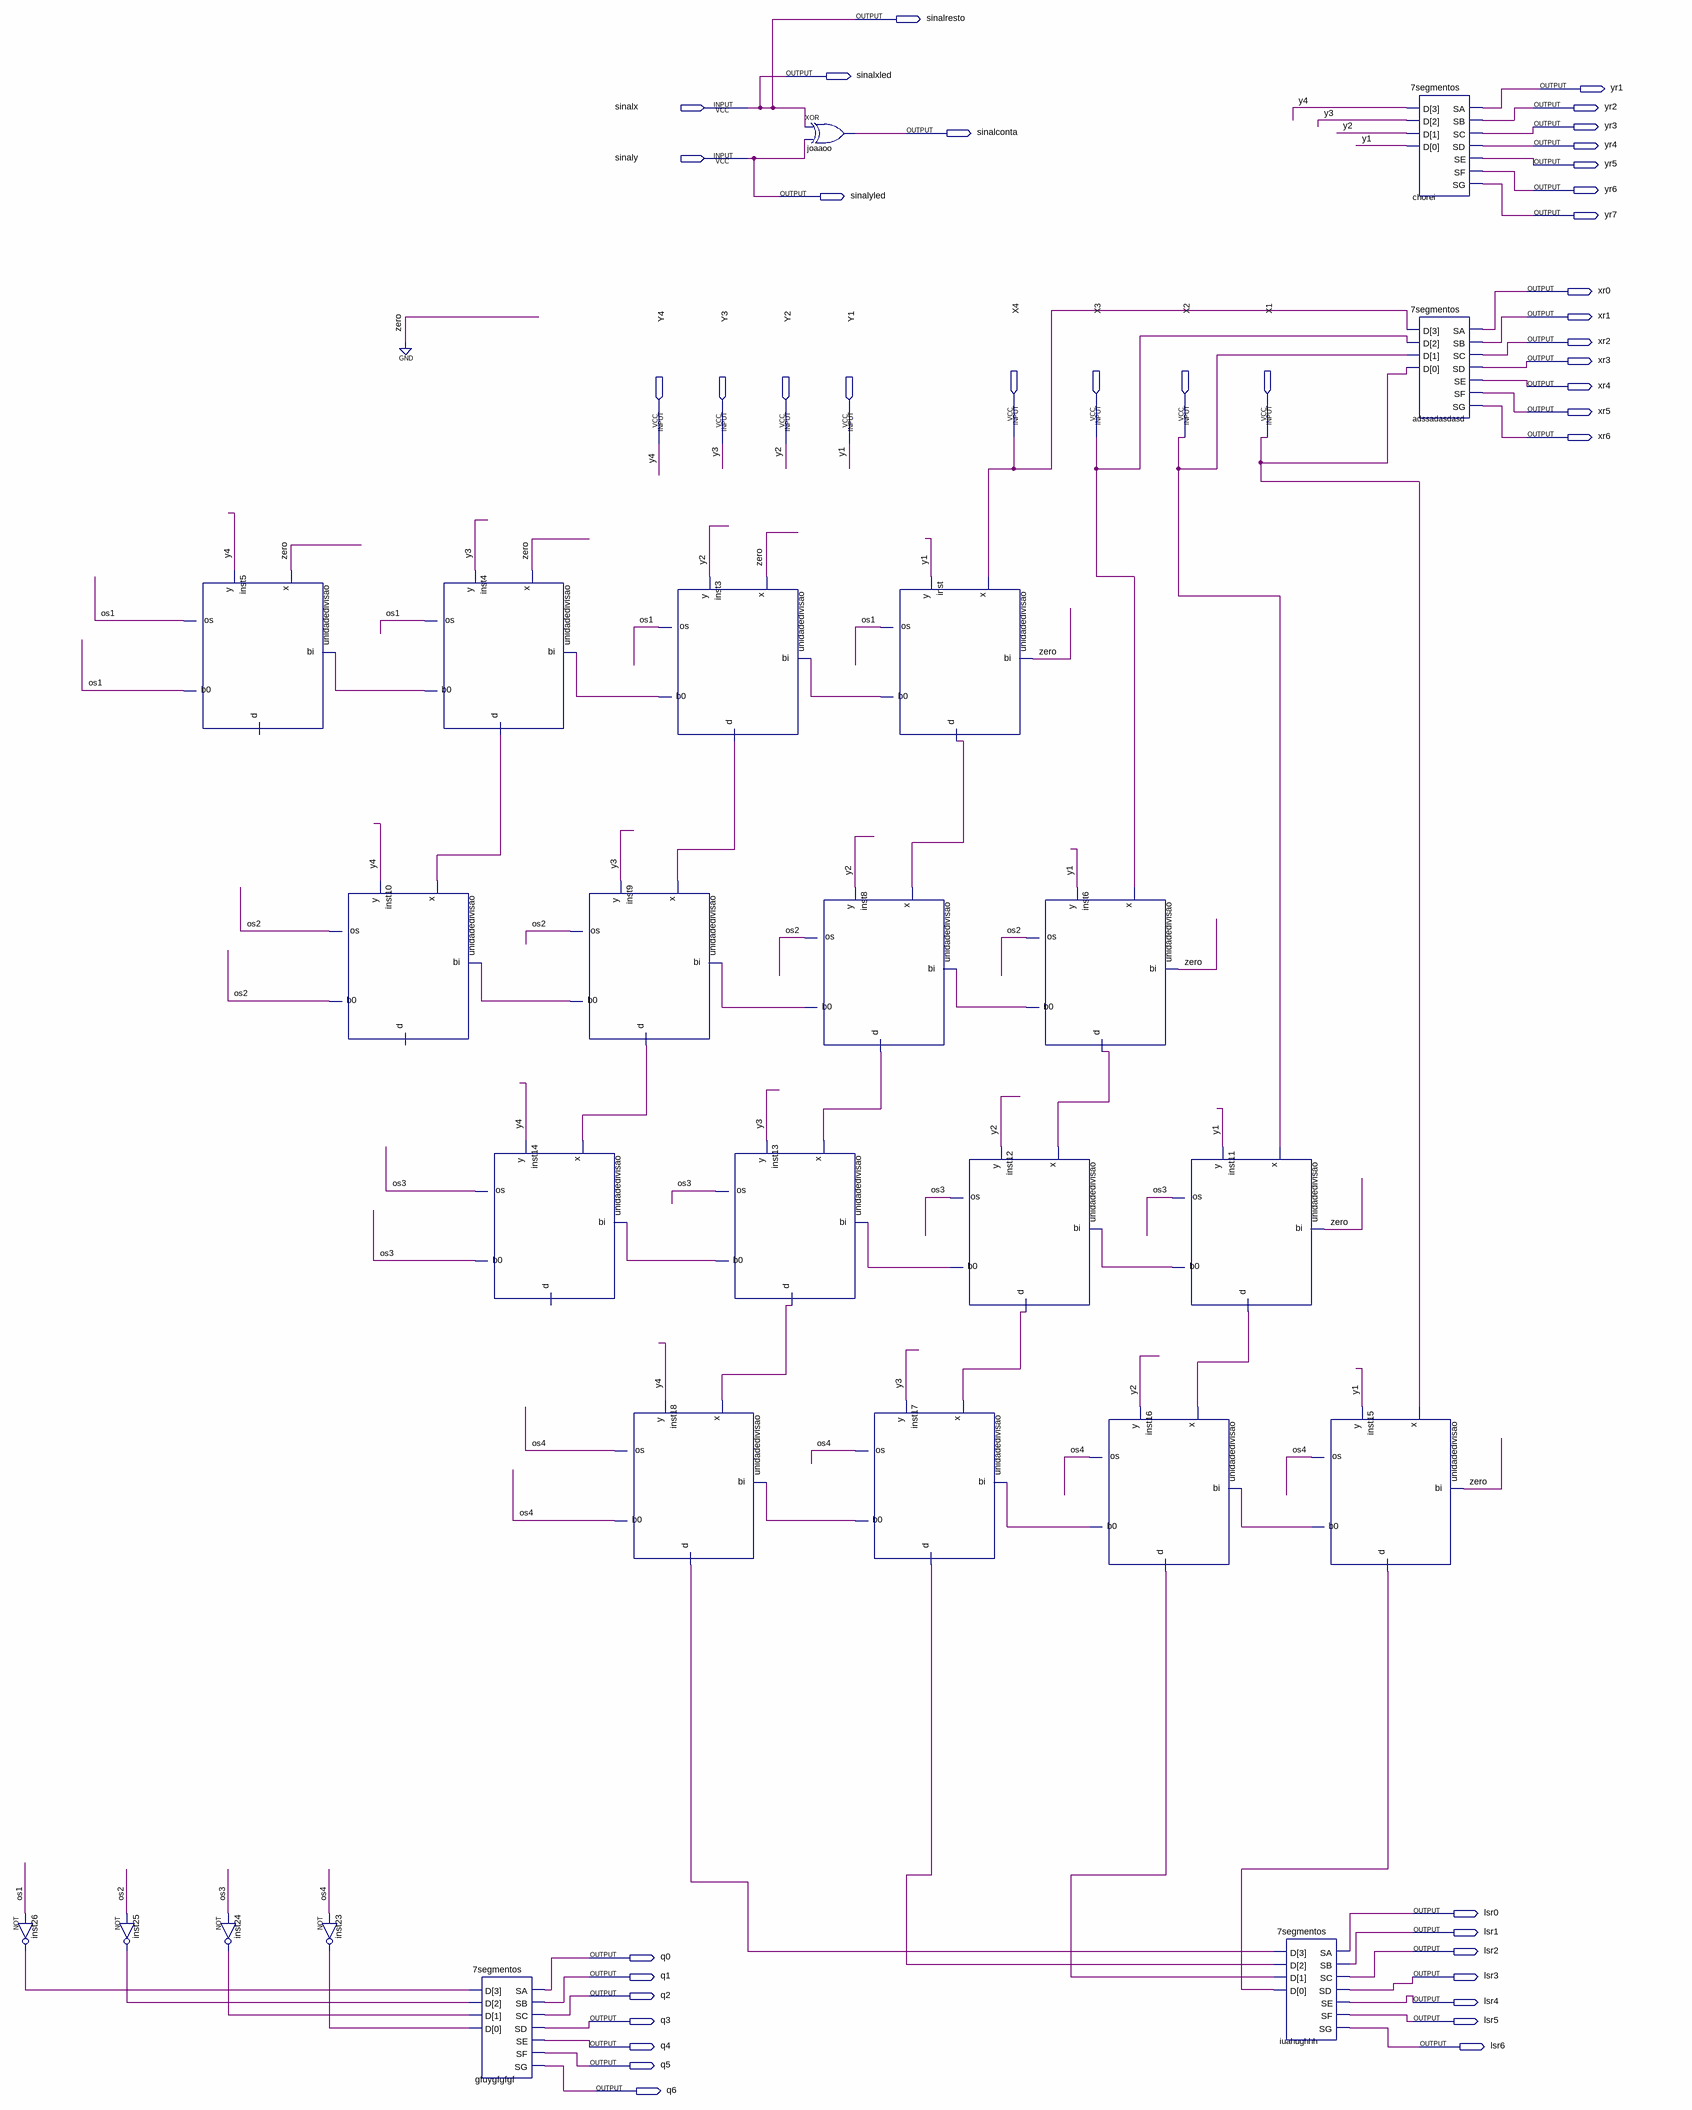
[diagram p0: schematic sheet]
// Quartus schematic divisor.bdf as structural Verilog: 25 symbols, 42 pins
module divisor (
  input  sinalx,
  input  sinaly,
  input  X4,
  input  X3,
  input  X2,
  input  X1,
  input  Y4,
  input  Y3,
  input  Y2,
  input  Y1,
  output sinalresto,
  output sinalxled,
  output yr1,
  output yr2,
  output yr3,
  output sinalconta,
  output yr4,
  output yr5,
  output yr6,
  output sinalyled,
  output yr7,
  output xr0,
  output xr1,
  output xr2,
  output xr3,
  output xr4,
  output xr5,
  output xr6,
  output lsr0,
  output lsr1,
  output lsr2,
  output q0,
  output q1,
  output lsr3,
  output q2,
  output lsr4,
  output q3,
  output lsr5,
  output q4,
  output lsr6,
  output q5,
  output q6
);

  wire inst3_b0, inst3_d, inst4_b0, inst4_d, inst6_b0, inst6_d, inst8_b0, inst8_d, inst9_b0, inst9_d,
       inst11_b0, inst11_d, inst12_b0, inst12_d, inst13_b0, inst13_d, inst15_b0, inst15_d, inst16_b0,
       inst16_d, inst17_b0, inst17_d, inst18_d, inst23_out, inst24_out, inst25_out, inst26_out, inst_b0,
       inst_d, os1, os2, os3, os4;

  not inst26 (inst26_out, os1);
  not inst25 (inst25_out, os2);
  unidadedivisao inst5 (.os(os1), .bi(inst4_b0), .y(Y4), .x(1'b0), .b0(os1));  // open: d
  not inst24 (inst24_out, os3);
  unidadedivisao inst10 (.os(os2), .bi(inst9_b0), .y(Y4), .x(inst4_d), .b0(os2));  // open: d
  not inst23 (inst23_out, os4);
  unidadedivisao inst4 (.os(os1), .bi(inst3_b0), .y(Y3), .x(1'b0), .b0(inst4_b0), .d(inst4_d));
  unidadedivisao inst14 (.os(os3), .bi(inst13_b0), .y(Y4), .x(inst9_d), .b0(os3));  // open: d
  \7segmentos  gfuygfgfgf (
    .D({inst26_out, inst25_out, inst24_out, inst23_out}), .SA(q0), .SB(q1), .SC(q2), .SD(q3), .SE(q4),
    .SF(q5), .SG(q6));
  unidadedivisao inst9 (.os(os2), .bi(inst8_b0), .y(Y3), .x(inst3_d), .b0(inst9_b0), .d(inst9_d));
  unidadedivisao inst18 (.os(os4), .bi(inst17_b0), .y(Y4), .x(inst13_d), .b0(os4), .d(inst18_d));
  unidadedivisao inst3 (.os(os1), .bi(inst_b0), .y(Y2), .x(1'b0), .b0(inst3_b0), .d(inst3_d));
  unidadedivisao inst13 (.os(os3), .bi(inst12_b0), .y(Y3), .x(inst8_d), .b0(inst13_b0), .d(inst13_d));
  xor joaaoo (sinalconta, sinalx, sinaly);
  unidadedivisao inst8 (.os(os2), .bi(inst6_b0), .y(Y2), .x(inst_d), .b0(inst8_b0), .d(inst8_d));
  unidadedivisao inst17 (.os(os4), .bi(inst16_b0), .y(Y3), .x(inst12_d), .b0(inst17_b0), .d(inst17_d));
  unidadedivisao inst (.os(os1), .bi(1'b0), .y(Y1), .x(X4), .b0(inst_b0), .d(inst_d));
  unidadedivisao inst12 (.os(os3), .bi(inst11_b0), .y(Y2), .x(inst6_d), .b0(inst12_b0), .d(inst12_d));
  unidadedivisao inst6 (.os(os2), .bi(1'b0), .y(Y1), .x(X3), .b0(inst6_b0), .d(inst6_d));
  unidadedivisao inst16 (.os(os4), .bi(inst15_b0), .y(Y2), .x(inst11_d), .b0(inst16_b0), .d(inst16_d));
  unidadedivisao inst11 (.os(os3), .bi(1'b0), .y(Y1), .x(X2), .b0(inst11_b0), .d(inst11_d));
  unidadedivisao inst15 (.os(os4), .bi(1'b0), .y(Y1), .x(X1), .b0(inst15_b0), .d(inst15_d));
  \7segmentos  iuahughhh (
    .D({inst18_d, inst17_d, inst16_d, inst15_d}), .SA(lsr0), .SB(lsr1), .SC(lsr2), .SD(lsr3), .SE(lsr4),
    .SF(lsr5), .SG(lsr6));
  \7segmentos  chorei (.D({Y4, Y3, Y2, Y1}), .SA(yr1), .SB(yr2), .SC(yr3), .SD(yr4), .SE(yr5), .SF(yr6), .SG(yr7));
  \7segmentos  adssadasdasd (
    .D({X4, X3, X2, X1}), .SA(xr0), .SB(xr1), .SC(xr2), .SD(xr3), .SE(xr4), .SF(xr5), .SG(xr6));

  assign sinalresto = sinalx;
  assign sinalxled = sinalx;
  assign sinalyled = sinaly;
endmodule
